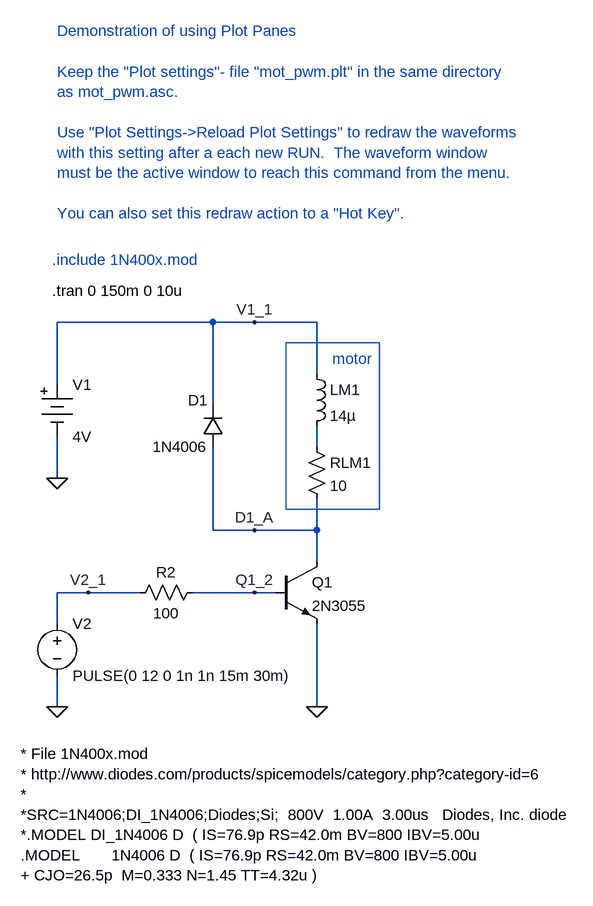
[diagram p0: schematic mot_pwm.asc]
mot_pwm.asc, the LTspice schematic file:
Version 4
SHEET 1 908 680
WIRE -256 -160 -256 -256
WIRE -256 -16 -256 -80
WIRE -256 208 -256 160
WIRE -256 336 -256 288
WIRE -208 160 -256 160
WIRE -128 160 -208 160
WIRE -16 -256 -256 -256
WIRE -16 -128 -16 -256
WIRE -16 64 -16 -64
WIRE 48 -256 -16 -256
WIRE 48 64 -16 64
WIRE 48 160 -48 160
WIRE 80 160 48 160
WIRE 144 -256 48 -256
WIRE 144 -176 144 -256
WIRE 144 -64 144 -96
WIRE 144 64 48 64
WIRE 144 64 144 16
WIRE 144 112 144 64
WIRE 144 336 144 208
FLAG -256 -16 0
FLAG 144 336 0
FLAG -256 336 0
FLAG 48 -256 V1_1
FLAG 48 64 D1_A
FLAG 48 160 Q1_2
FLAG -208 160 V2_1
SYMBOL npn 80 112 R0
SYMATTR InstName Q1
SYMATTR Value 2N3055
SYMBOL ind 128 -192 R0
SYMATTR InstName LM1
SYMATTR Value 14µ
SYMBOL res 128 -80 R0
SYMATTR InstName RLM1
SYMATTR Value 10
SYMBOL diode 0 -64 R180
WINDOW 0 24 72 Left 0
WINDOW 3 24 0 Left 0
SYMATTR InstName D1
SYMATTR Value 1N4006
SYMBOL Misc\\battery -256 -176 R0
SYMATTR InstName V1
SYMATTR Value 4V
SYMBOL res -144 176 R270
WINDOW 0 32 56 VTop 0
WINDOW 3 0 56 VBottom 0
SYMATTR InstName R2
SYMATTR Value 100
SYMBOL voltage -256 192 R0
WINDOW 123 0 0 Left 0
WINDOW 39 0 0 Left 0
SYMATTR InstName V2
SYMATTR Value PULSE(0 12 0 1n 1n 15m 30m)
TEXT 168 -200 Left 0 ;motor
TEXT -264 -304 Left 0 !.tran 0 150m 0 10u
TEXT -312 408 Left 0 !* File 1N400x.mod\n* http://www.diodes.com/products/spicemodels/category.php?category-id=6\n*\n*SRC=1N4006;DI_1N4006;Diodes;Si;  800V  1.00A  3.00us   Diodes, Inc. diode\n*.MODEL DI_1N4006 D  ( IS=76.9p RS=42.0m BV=800 IBV=5.00u\n.MODEL       1N4006 D  ( IS=76.9p RS=42.0m BV=800 IBV=5.00u\n+ CJO=26.5p  M=0.333 N=1.45 TT=4.32u )
TEXT -264 -352 Left 0 ;.include 1N400x.mod
TEXT -256 -704 Left 0 ;Demonstration of using Plot Panes\n \nKeep the "Plot settings"- file "mot_pwm.plt" in the same directory \nas mot_pwm.asc. \n \nUse "Plot Settings->Reload Plot Settings" to redraw the waveforms \nwith this setting after a each new RUN.  The waveform window\nmust be the active window to reach this command from the menu.\n \nYou can also set this redraw action to a "Hot Key".
RECTANGLE Normal 240 32 96 -224

The netlist it stands for:
* mot_pwm.asc
Q1 D1_A Q1_2 0 0 2N3055
LM1 V1_1 N001 14µ
RLM1 N001 D1_A 10
D1 D1_A V1_1 1N4006
V1 V1_1 0 4V
R2 V2_1 Q1_2 100
V2 V2_1 0 PULSE(0 12 0 1n 1n 15m 30m)
.model D D
.lib standard.dio
.model NPN NPN
.model PNP PNP
.lib standard.bjt
* motor
.tran 0 150m 0 10u
* File 1N400x.mod
* http://www.diodes.com/products/spicemodels/category.php?category-id=6
*
*SRC=1N4006;DI_1N4006;Diodes;Si;  800V  1.00A  3.00us   Diodes, Inc. diode
*.MODEL DI_1N4006 D  ( IS=76.9p RS=42.0m BV=800 IBV=5.00u
.MODEL       1N4006 D  ( IS=76.9p RS=42.0m BV=800 IBV=5.00u
+ CJO=26.5p  M=0.333 N=1.45 TT=4.32u )
* .include 1N400x.mod
* Demonstration of using Plot Panes
* Keep the "Plot settings"- file "mot_pwm.plt" in the same directory
* as mot_pwm.asc.
* Use "Plot Settings->Reload Plot Settings" to redraw the waveforms
* with this setting after a each new RUN.  The waveform window
* must be the active window to reach this command from the menu.
* You can also set this redraw action to a "Hot Key".
.backanno
.end